# EasyEDA Pro project ProDoc_PCB1_2026-06-03.epro

# Board PCB1
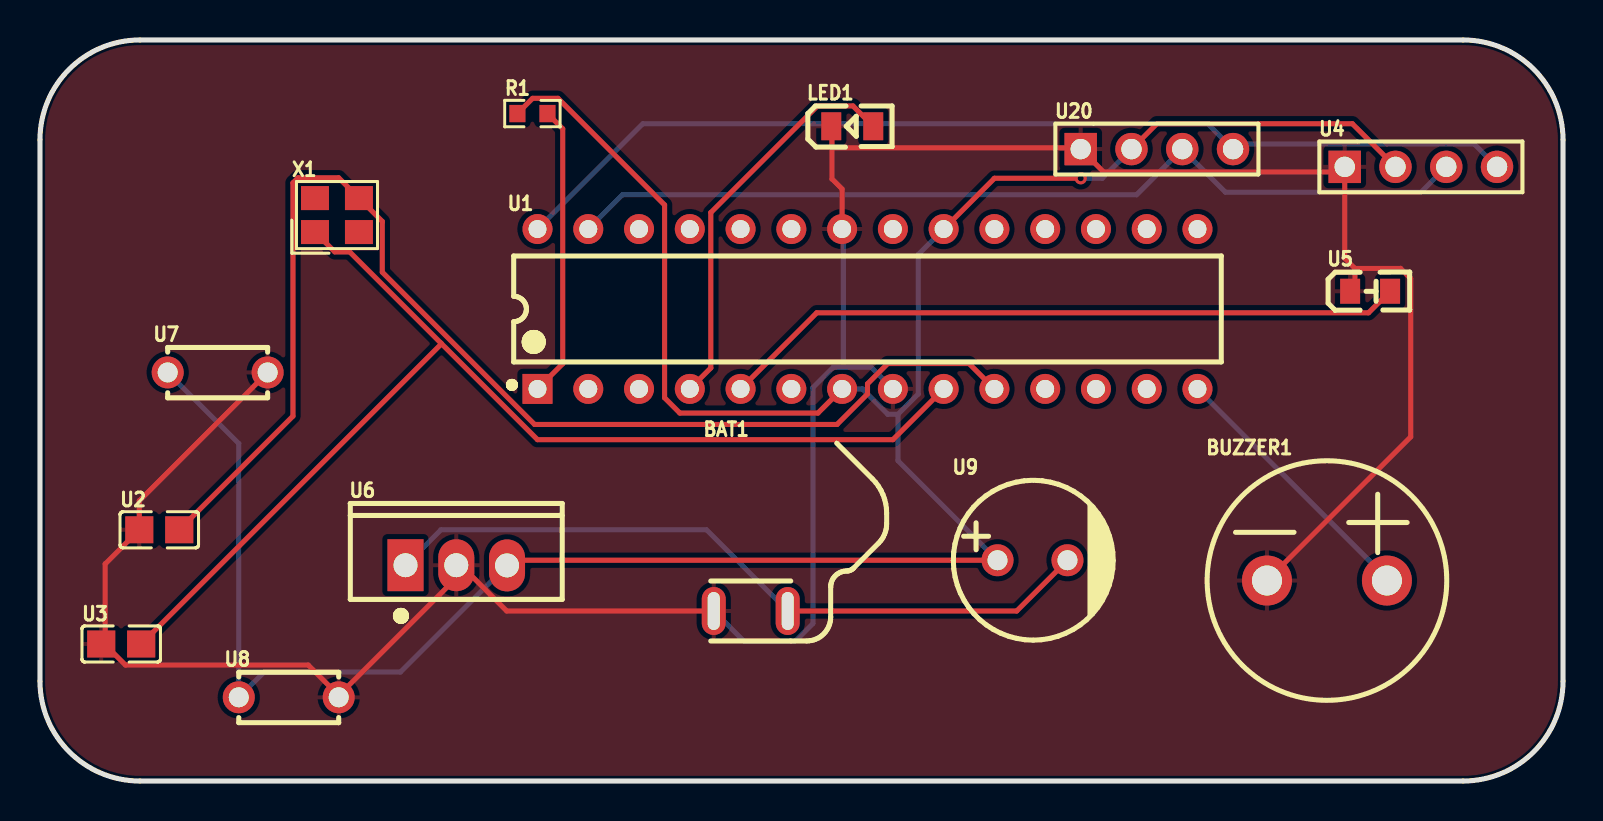
[diagram p0: board, top side]
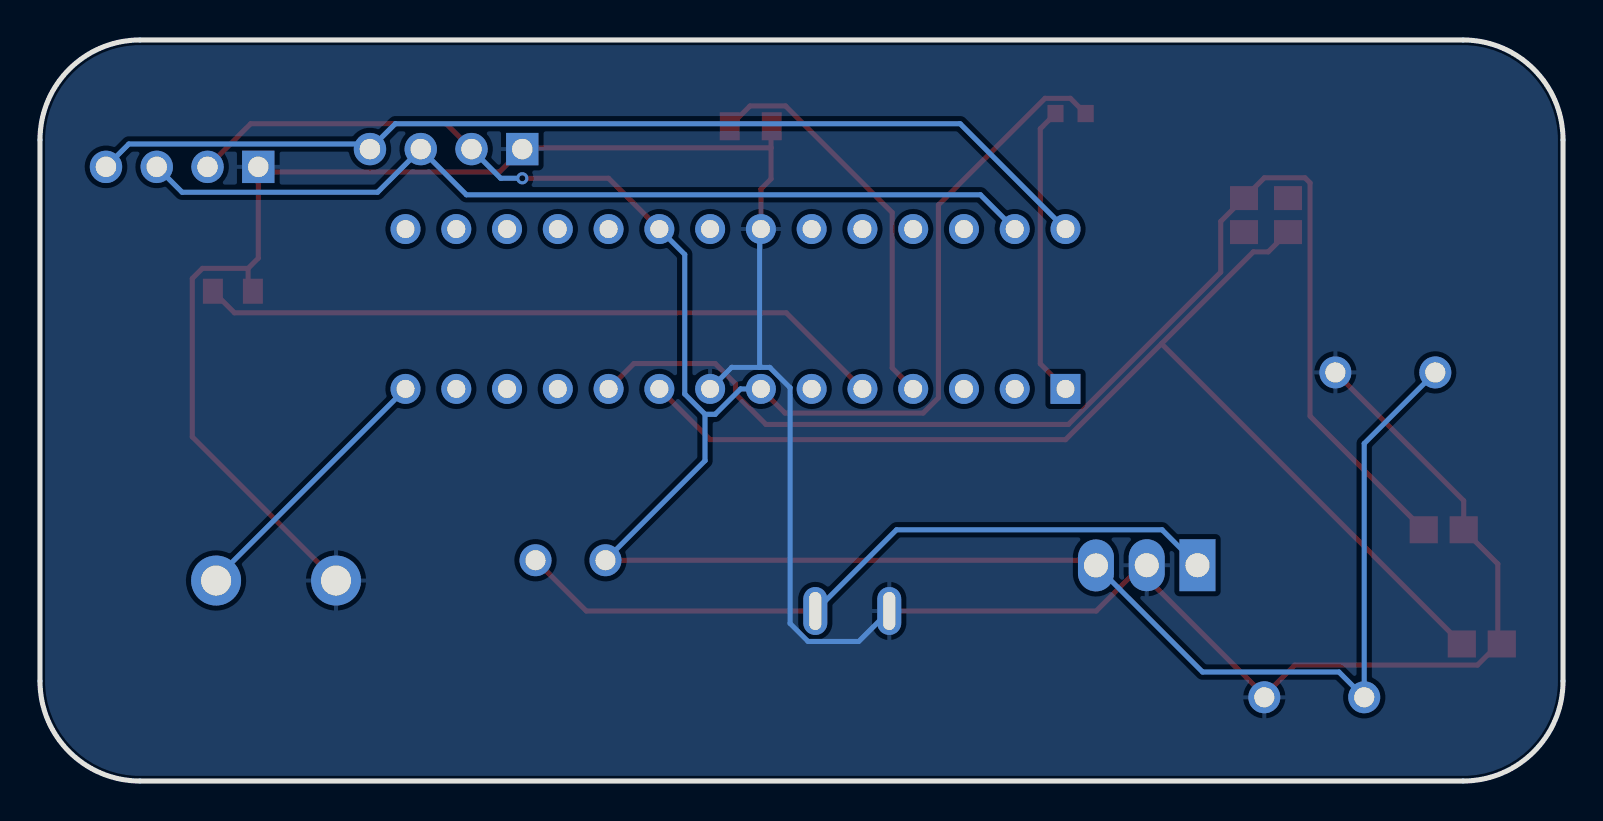
[diagram p1: board, bottom side, seen from below]

Outline 76.2 x 37.08 mm; copper layers: Top Layer, Bottom Layer. Coordinates in mm from the lower left corner of the outline.
Outline path: 0,32.08 0,5 arc(1.46,1.46) 5,0 71.2,0 arc(74.74,1.46) 76.2,5 76.2,32.08 arc(74.74,35.62) 71.2,37.08 5,37.08 arc(1.46,35.62) 0,32.08
Stack: Top Layer 0.035mm / Dielectric1 1.51mm FR4 er 4.5 / Bottom Layer 0.035mm

## Design rules (mm)
spacing copperThickness1oz (default): track to track 0.102, other pairs 0.152 to 0.3
spacing copperThickness2oz: track to track 0.203, other pairs 0.152 to 0.3
track width copperThickness1oz (default): min 0.127, default 0.254, max 2.54
track width copperThickness2oz: min 0.203, default 0.254, max 2.54
differential pair differentialPair (default): width min 0.127, default 0.254, max 2.54; gap min 0.152, default 0.152
net GND uses copperRegion

## Placement (name value [footprint] x y rotation side)
BAT1  电池弹片  [BAT-TH_L4.0-W3.0-P3.7]  35.56 8.51 0 top
BUZZER1  buzzer  [BUZ-TH_BD12.0-P6.00-D0.9-RD]  64.39 10.03 0 top
LED1  KT-0805G  [LED0805-R-RD]  40.64 32.77 0 top
R1  10kΩ  [R0603]  24.64 33.4 0 top
U1  ATMEGA328P-PU  [DIP-28_L34.6-W7.3-P2.54-LS10.2-BL]  41.4 23.62 0 top
U2  22pF  [C0805]  5.97 12.57 0 top
U3  22pF  [C0805]  4.06 6.86 0 top
U4  HDR-M_2.54_1x4P  [HDR-TH_HDR-M_2.54_1X4P]  69.09 30.73 0 top
U5  0805 SF-Red  [LED0805-RD_RED]  66.55 24.51 0 top
U6  LM7805  [TO-220-3_L10.0-W4.5-P2.54-L]  20.83 10.8 0 top
U7  100nF  [CAP-TH_L5.0-W2.5-P5.00-D1.0]  8.89 20.45 0 top
U8  100nF  [CAP-TH_L5.0-W2.5-P5.00-D1.0]  12.45 4.19 0 top
U9  CAP-DIP-P3.5*Φ8*14-680uF-16V-20%  [CAP-TH_BD8.0-P3.50-D0.5-FD]  49.66 11.05 0 top
U20  HDR-M_2.54_1x4P  [HDR-TH_HDR-M_2.54_1X4P]  55.88 31.62 0 top
X1  16MHz  [CRYSTAL-SMD_4P-L3.2-W2.5-BL]  14.86 28.32 0 top

## Footprints (pads in the part's own frame, mm; a bottom-side part is the same pattern mirrored in y, then rotated)
BAT-TH_L4.0-W3.0-P3.7
  oval 1.2x2.4 hole 0.6x1.9: 1(-1.85,0) 2(1.85,0)
BUZ-TH_BD12.0-P6.00-D0.9-RD
  round 2.5 hole 1.5: 1(-3,0) 2(3,0)
C0805
  rect 1.41x1.35 smd: 1(-1,0) 2(1,0)
CAP-TH_BD8.0-P3.50-D0.5-FD
  round 1.6 hole 1: 1(-1.75,0) 2(1.75,0)
CAP-TH_L5.0-W2.5-P5.00-D1.0
  round 1.6 hole 1: 1(-2.5,0) 2(2.5,0)
CRYSTAL-SMD_4P-L3.2-W2.5-BL
  rect 1.4x1.2 smd: 1(-1.1,-0.85) 2(1.1,-0.85) 3(1.1,0.85) 4(-1.1,0.85)
DIP-28_L34.6-W7.3-P2.54-LS10.2-BL
  rect 1.5x1.5 hole 0.9: 1(-16.51,-4)
  round 1.5 hole 0.9: 2(-13.97,-4) 3(-11.43,-4) 4(-8.89,-4) 5(-6.35,-4) 6(-3.81,-4) 7(-1.27,-4) 8(1.27,-4) 9(3.81,-4) 10(6.35,-4) 11(8.89,-4) 12(11.43,-4) 13(13.97,-4) 14(16.51,-4) 15(16.51,4) 16(13.97,4) 17(11.43,4) 18(8.89,4) 19(6.35,4) 20(3.81,4) 21(1.27,4) 22(-1.27,4) 23(-3.81,4) 24(-6.35,4) 25(-8.89,4) 26(-11.43,4) 27(-13.97,4) 28(-16.51,4)
HDR-TH_HDR-M_2.54_1X4P
  rect 1.62x1.62 hole 1.02: 1(-3.81,0)
  round 1.62 hole 1.02: 2(-1.27,0) 3(1.27,0) 4(3.81,0)
LED0805-R-RD
  rect 1x1.399 smd: 1(1.05,0) 2(-1.05,0)
LED0805-RD_RED
  rect 1x1.25 smd: 1(-1,0) 2(1,0)
R0603
  rect 0.806x0.864 smd: 1(-0.753,0) 2(0.753,0)
TO-220-3_L10.0-W4.5-P2.54-L
  rect 1.8x2.6 hole 1.2: 1(-2.54,0.005)
  oval 1.8x2.6 hole 1.2: 2(0,0.005) 3(2.54,-0.005)

## Nets
GND: BAT1.1 BUZZER1.1 LED1.2 U1.8 U1.22 U2.1 U3.1 U4.1 U5.1 U6.2 U7.2 U8.2 U20.1
VCC: R1.1 U1.7 U1.20 U4.2 U6.3 U7.1 U8.1 U9.1 U20.2
$1N1: U1.9 U3.2 X1.1
$1N2: U1.10 U2.2 X1.3
$1N5: R1.2 U1.1
$1N6: U1.27 U4.3 U20.3
$1N7: U1.28 U4.4 U20.4
$1N8: BUZZER1.2 U1.14
$1N9: LED1.1 U1.4
$1N10: U1.5 U5.2
$1N11: BAT1.2 U6.1 U9.2

Pads without a net: U1 2 3 6 11 12 13 15 16 17 18 19 21 23 24 25 26; X1 2 4

## Via types
v1: diameter 0.61, hole 0.305, Top Layer to Bottom Layer, 1 via

## Routing (per net, layer and track width the routed paths; a pad name or vN(x,y) marks a point on that pad's centre or on a via; arc(x,y) is an arc through that point)
GND: length 141.6
  Top Layer w0.254: 21.26,10.6 14.95,4.28 ; 21.26,10.6 23.35,8.51 BAT1.1 ; 21.26,10.6 21.06,10.8 U6.2 ; 14.95,4.28 U8.2 ; 14.95,4.28 13.42,5.8 4.28,5.8 3.26,6.82 ; 39.62,31.69 52.01,31.69 U20.1 53.21,30.48 65.02,30.48 U4.1 65.28,26.16 65.79,25.65 ; 39.62,31.69 39.62,30.13 40.13,29.62 U1.22 ; 39.62,31.69 39.62,32.73 LED1.2 ; 3.26,6.82 U3.1 ; 3.26,6.82 3.26,10.87 U2.1 4.97,14.03 U7.2 ; BUZZER1.1 68.58,17.22 68.58,25.15 68.07,25.65 65.79,25.65 ; U5.1 65.79,24.75 65.79,25.65
  Bottom Layer w0.254: 40.19,20.7 39.69,20.7 38.67,19.69 38.67,7.88 37.77,6.98 35.23,6.98 BAT1.1 ; 40.19,20.7 40.19,27.56 U1.22 ; 40.19,20.7 41.59,20.7 U1.8
VCC: length 136.4
  Top Layer w0.254: U20.2 55.88,32.89 65.66,32.89 U4.2 ; U1.20 47.75,30.16 v1(52.07,30.16) ; U6.3 23.63,11.05 U9.1 ; R1.1 24.65,34.16 25.92,34.16 31.25,28.83 31.25,19.18 32.01,18.42 38.92,18.42 U1.7
  Bottom Layer w0.254: v1(52.07,30.16) 53.15,30.16 U20.2 ; 42.93,18.35 43.94,19.37 43.94,26.35 U1.20 ; 42.93,18.35 42.42,18.35 41.15,19.62 U1.7 ; 42.93,18.35 42.93,16.03 U9.1 ; U6.3 18.03,5.46 11.21,5.46 U8.1 9.95,16.89 U7.1
$1N1: length 58.1
  Top Layer w0.254: 20.07,21.91 20.07,21.86 U3.2 ; 20.07,21.91 15.49,26.48 14.75,26.48 X1.1 ; 20.07,21.91 24.89,17.08 42.67,17.08 U1.9
$1N2: length 63.6
  Top Layer w0.254: U1.10 46.48,20.89 42.42,20.89 41.4,19.88 41.4,19.37 39.88,17.84 24.75,17.84 17.13,25.46 17.13,28 X1.3 14.94,30.19 12.91,30.19 12.66,29.93 12.66,18.26 U2.2
$1N5: length 14.6
  Top Layer w0.254: U1.1 26.15,20.88 26.15,32.64 R1.2
$1N6: length 46
  Bottom Layer w0.254: U1.27 29.15,29.34 54.86,29.34 U20.3 59.31,29.46 69.09,29.46 U4.3
$1N7: length 51.3
  Bottom Layer w0.254: U4.4 71.75,31.88 59.94,31.88 U20.4 58.42,32.89 30.16,32.89 U1.28
$1N8: length 13.5
  Bottom Layer w0.254: BUZZER1.2 67.39,10.15 U1.14
$1N9: length 20
  Top Layer w0.254: U1.4 33.56,20.67 33.56,28.45 38.9,33.78 40.67,33.78 LED1.1
$1N10: length 34.5
  Top Layer w0.254: U5.2 66.47,23.43 38.86,23.43 U1.5
$1N11: length 36.6
  Top Layer w0.254: BAT1.2 48.87,8.51 U9.2
  Bottom Layer w0.254: BAT1.2 33.35,12.57 20.06,12.57 U6.1

## Copper pours and planes (outline as drawn; the poured copper is in the pictures)
GND on Top Layer: -0.25,37.21 76.96,37.21 76.96,-0.38 -0.25,-0.38
GND on Bottom Layer: -0.89,37.59 76.84,37.59 76.84,-0.25 -0.89,-0.25
